# EAGLE schematic PWM (EAGLE 8.0.1)
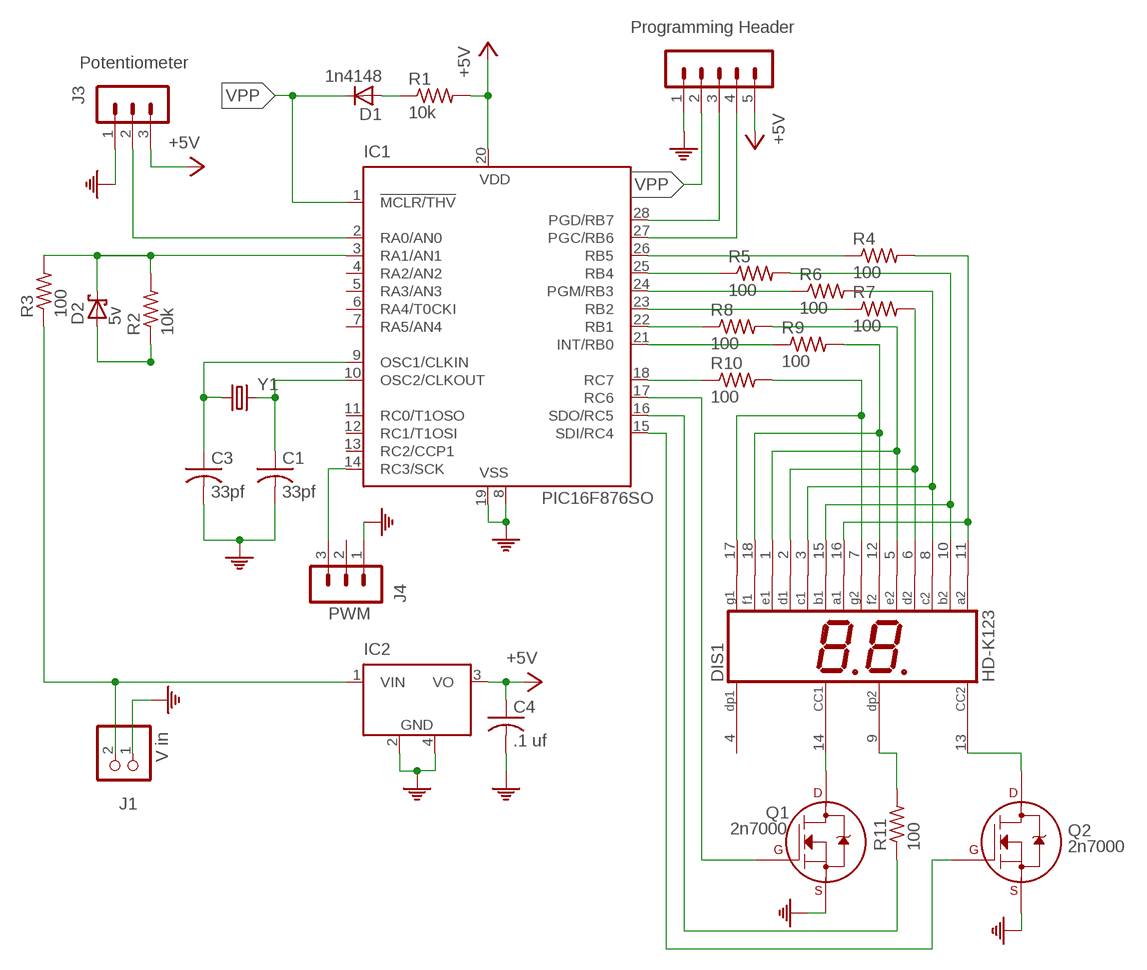
[diagram p0: schematic, sheet 1]

## Parts
C1  33pf  C-USC0402K  [C0402K]
C3  33pf  C-USC0402K  [C0402K]
C4  .1 uf  C-USC0402K  [C0402K]
D1  1n4148  D-SOD123  [SOD123]
D2  5v  BAT60J  [SOD323_ST]
DIS1  HD-K123  [HDSP-R]
IC1  PIC16F876SO  [SO28W]
IC2  LM2936MP-5.0  [SOT223]
J1  V in  PINHD-1X2  [1X02]
J2  Programming Header  MA05-1  [MA05-1]
J3  Potentiometer  MA03-1  [MA03-1]
J4  PWM  MA03-1  [MA03-1]
Q1  2n7000  2N7000_TO92  [TO-92]
Q2  2n7000  2N7000_TO92  [TO-92]
R1  10k  R-US_R2012  [R2012]
R2  10k  R-US_R2012  [R2012]
R3  100  R-US_R2012  [R2012]
R4  100  R-US_R2012  [R2012]
R5  100  R-US_R2012  [R2012]
R6  100  R-US_R2012  [R2012]
R7  100  R-US_R2012  [R2012]
R8  100  R-US_R2012  [R2012]
R9  100  R-US_R2012  [R2012]
R10  100  R-US_R2012  [R2012]
R11  100  R-US_R2012  [R2012]
Y1  CRYSTALHC49S  [HC49/S]

## Nets
+5V: C4.1 IC1.20(VDD) IC2.3(VO) J2.5 J3.3 R1.2
N$1: C3.1 IC1.9(OSC1/CLKIN) Y1.1
N$2: C1.1 IC1.10(OSC2/CLKOUT) Y1.2
N$3: IC1.28(PGD/RB7) J2.3
N$4: IC1.27(PGC/RB6) J2.4
N$5: D1.2(A) R1.1
N$6: IC1.2(RA0/AN0) J3.2
N$7: D2.C IC1.3(RA1/AN1) R2.2 R3.2
N$8: IC1.26(RB5) R4.1
N$9: DIS1.11(A2) DIS1.16(A1) R4.2
N$10: IC1.25(RB4) R5.1
N$11: IC1.14(RC3/SCK) J4.3
N$12: DIS1.10(B2) DIS1.15(B1) R5.2
N$13: IC1.24(PGM/RB3) R6.1
N$14: DIS1.3(C1) DIS1.8(C2) R6.2
N$15: IC1.23(RB2) R7.1
N$16: DIS1.14(CC1) Q1.3(D)
N$17: IC1.22(RB1) R8.1
N$18: DIS1.1(E1) DIS1.5(E2) R8.2
N$20: IC1.21(INT/RB0) R9.1
N$21: DIS1.12(F2) DIS1.18(F1) R9.2
N$22: IC1.18(RC7) R10.1
N$23: DIS1.7(G2) DIS1.17(G1) R10.2
N$24: IC1.16(SDO/RC5) R11.1
N$25: DIS1.9(DP2) R11.2
N$26: IC1.17(RC6) Q1.2(G)
N$27: IC1.15(SDI/RC4) Q2.2(G)
N$28: DIS1.2(D1) DIS1.6(D2) R7.2
N$29: DIS1.13(CC2) Q2.3(D)
N$30: IC2.1(VIN) J1.2 R3.1
N$31: D2.A R2.1
PE: C1.2 C3.2 C4.2 IC1.8(VSS) IC1.19(VSS) IC2.2(GND) IC2.4(GND) J1.1 J2.1 J3.1 J4.1 Q1.1(S) Q2.1(S)
VPP: D1.1(C) IC1.1(!MCLR/THV) J2.2
Unconnected: DIS1.4(DP1) IC1.4(RA2/AN2) IC1.5(RA3/AN3) IC1.6(RA4/T0CKI) IC1.7(RA5/AN4) IC1.11(RC0/T1OSO) IC1.12(RC1/T1OSI) IC1.13(RC2/CCP1) J4.2

## Library data of the parts
C1 C3 C4 = resistor:C-US: CAPACITOR, American symbol
D1 = semicon-smd-ipc:D-: DIODE unfilled
D2 = diode:BAT60J: Schottky barrier diode Source: www.st.com, BAT60J.pdf
DIS1 = display-hp:HD-K123: LED DISPLAY 2 x 1 character 7 segment, decimal points right; OC_FARNELL: unknown; OC_NEWARK: unknown
IC1 = microchip:PIC16*876: MICROCONTROLLER flash type; MF: MICROCHIP; MPN: PIC16F876-20/SO; OC_FARNELL: 9761268; OC_NEWARK: 12C1950
IC2 = national-semiconductor:LM2936MP?*: Ultra-Low Quiescent Current LDO Voltage Regulator Source: Data sheet <http://www.national.com/ds/LM/LM2936.pdf>; MF: NATIONAL SEMICONDUCTOR; MPN: LM2936MP-5.0/NOPB; OC_FARNELL: 1469063; OC_NEWARK: 41K4524
J1 = pinhead:PINHD-1X2: PIN HEADER
J2 = con-lstb:MA05-1: PIN HEADER; OC_FARNELL: unknown; OC_NEWARK: unknown
J3 J4 = con-lstb:MA03-1: PIN HEADER; OC_FARNELL: unknown; OC_NEWARK: unknown
Q1 Q2 = transistors:2N700*: 2N7000, 2N7002, NDS7002A N-channel enhancement mode MOSFET
R1-R11 = resistor:R-US_: RESISTOR, American symbol
Y1 = crystal:CRYSTAL: CRYSTAL; OC_FARNELL: 1667008; OC_NEWARK: unknown